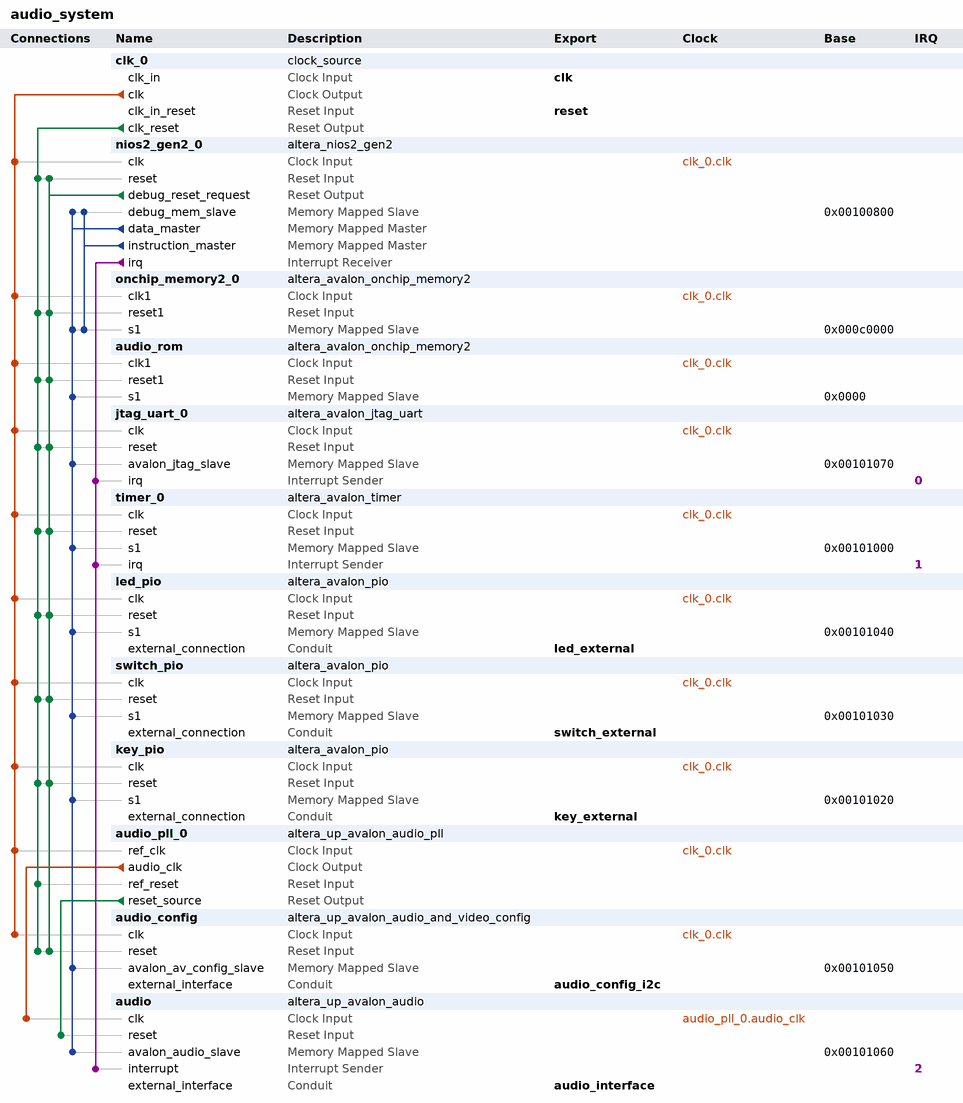
[diagram p0: system contents]
# Platform Designer (Qsys) system audio_system, Cyclone V 5CSXFC6D6F31C6
# Parameters at their usual value, and those the tool derives, are not listed.
package require -exact qsys 23.1
create_system audio_system
set_project_property DEVICE_FAMILY {Cyclone V}
set_project_property DEVICE 5CSXFC6D6F31C6

add_instance clk_0 clock_source 23.1
set_instance_parameter_value clk_0 clockFrequency 50000000

add_instance nios2_gen2_0 altera_nios2_gen2 23.1
set_instance_parameter_value nios2_gen2_0 dcache_size 2048
set_instance_parameter_value nios2_gen2_0 exceptionSlave onchip_memory2_0.s1
set_instance_parameter_value nios2_gen2_0 icache_size 4096
set_instance_parameter_value nios2_gen2_0 impl Tiny
set_instance_parameter_value nios2_gen2_0 resetSlave onchip_memory2_0.s1

add_instance onchip_memory2_0 altera_avalon_onchip_memory2 23.1
set_instance_parameter_value onchip_memory2_0 dataWidth 32
set_instance_parameter_value onchip_memory2_0 dualPort false
set_instance_parameter_value onchip_memory2_0 initMemContent true
set_instance_parameter_value onchip_memory2_0 initializationFileName onchip_mem.hex
set_instance_parameter_value onchip_memory2_0 memorySize 32767

add_instance audio_rom altera_avalon_onchip_memory2 23.1
set_instance_parameter_value audio_rom dataWidth 16
set_instance_parameter_value audio_rom dualPort false
set_instance_parameter_value audio_rom initMemContent true
set_instance_parameter_value audio_rom initializationFileName D:/FETEL_WorkDir/Y4S2_HeThongNhung/DE10_Standard_Audio/audio_data.mif
set_instance_parameter_value audio_rom memorySize 240254
set_instance_parameter_value audio_rom useNonDefaultInitFile true
set_instance_parameter_value audio_rom writable false

add_instance jtag_uart_0 altera_avalon_jtag_uart 23.1
set_instance_parameter_value jtag_uart_0 simInteractiveOptions NO_INTERACTIVE_WINDOWS

add_instance timer_0 altera_avalon_timer 23.1
set_instance_parameter_value timer_0 period 1
set_instance_parameter_value timer_0 periodUnits MSEC

add_instance led_pio altera_avalon_pio 23.1
set_instance_parameter_value led_pio direction Output
set_instance_parameter_value led_pio width 32

add_instance switch_pio altera_avalon_pio 23.1
set_instance_parameter_value switch_pio direction Input
set_instance_parameter_value switch_pio width 32

add_instance key_pio altera_avalon_pio 23.1
set_instance_parameter_value key_pio direction Input
set_instance_parameter_value key_pio width 32

add_instance audio_pll_0 altera_up_avalon_audio_pll 18.0
set_instance_parameter_value audio_pll_0 gui_refclk 50.0

add_instance audio_config altera_up_avalon_audio_and_video_config 18.0
set_instance_parameter_value audio_config audio_in {Line In to ADC}
set_instance_parameter_value audio_config bit_length 16
set_instance_parameter_value audio_config board DE10-Standard
set_instance_parameter_value audio_config line_in_bypass false
set_instance_parameter_value audio_config sampling_rate {48 kHz}

add_instance audio altera_up_avalon_audio 18.0
set_instance_parameter_value audio audio_in true
set_instance_parameter_value audio avalon_bus_type {Memory Mapped}
set_instance_parameter_value audio dw 16

# connections
add_connection audio_pll_0.audio_clk audio.clk clock
add_connection clk_0.clk audio_config.clk clock
add_connection clk_0.clk audio_pll_0.ref_clk clock
add_connection clk_0.clk audio_rom.clk1 clock
add_connection clk_0.clk jtag_uart_0.clk clock
add_connection clk_0.clk key_pio.clk clock
add_connection clk_0.clk led_pio.clk clock
add_connection clk_0.clk nios2_gen2_0.clk clock
add_connection clk_0.clk onchip_memory2_0.clk1 clock
add_connection clk_0.clk switch_pio.clk clock
add_connection clk_0.clk timer_0.clk clock
add_connection audio_pll_0.reset_source audio.reset reset
add_connection clk_0.clk_reset audio_config.reset reset
add_connection clk_0.clk_reset audio_pll_0.ref_reset reset
add_connection clk_0.clk_reset audio_rom.reset1 reset
add_connection clk_0.clk_reset jtag_uart_0.reset reset
add_connection clk_0.clk_reset key_pio.reset reset
add_connection clk_0.clk_reset led_pio.reset reset
add_connection clk_0.clk_reset nios2_gen2_0.reset reset
add_connection clk_0.clk_reset onchip_memory2_0.reset1 reset
add_connection clk_0.clk_reset switch_pio.reset reset
add_connection clk_0.clk_reset timer_0.reset reset
add_connection nios2_gen2_0.debug_reset_request audio_config.reset reset
add_connection nios2_gen2_0.debug_reset_request audio_rom.reset1 reset
add_connection nios2_gen2_0.debug_reset_request jtag_uart_0.reset reset
add_connection nios2_gen2_0.debug_reset_request key_pio.reset reset
add_connection nios2_gen2_0.debug_reset_request led_pio.reset reset
add_connection nios2_gen2_0.debug_reset_request nios2_gen2_0.reset reset
add_connection nios2_gen2_0.debug_reset_request onchip_memory2_0.reset1 reset
add_connection nios2_gen2_0.debug_reset_request switch_pio.reset reset
add_connection nios2_gen2_0.debug_reset_request timer_0.reset reset
add_connection nios2_gen2_0.data_master audio.avalon_audio_slave avalon
set_connection_parameter_value nios2_gen2_0.data_master/audio.avalon_audio_slave baseAddress 0x00101060
add_connection nios2_gen2_0.data_master audio_config.avalon_av_config_slave avalon
set_connection_parameter_value nios2_gen2_0.data_master/audio_config.avalon_av_config_slave baseAddress 0x00101050
add_connection nios2_gen2_0.data_master audio_rom.s1 avalon
set_connection_parameter_value nios2_gen2_0.data_master/audio_rom.s1 baseAddress 0x0000
add_connection nios2_gen2_0.data_master jtag_uart_0.avalon_jtag_slave avalon
set_connection_parameter_value nios2_gen2_0.data_master/jtag_uart_0.avalon_jtag_slave baseAddress 0x00101070
add_connection nios2_gen2_0.data_master key_pio.s1 avalon
set_connection_parameter_value nios2_gen2_0.data_master/key_pio.s1 baseAddress 0x00101020
add_connection nios2_gen2_0.data_master led_pio.s1 avalon
set_connection_parameter_value nios2_gen2_0.data_master/led_pio.s1 baseAddress 0x00101040
add_connection nios2_gen2_0.data_master nios2_gen2_0.debug_mem_slave avalon
set_connection_parameter_value nios2_gen2_0.data_master/nios2_gen2_0.debug_mem_slave baseAddress 0x00100800
add_connection nios2_gen2_0.data_master onchip_memory2_0.s1 avalon
set_connection_parameter_value nios2_gen2_0.data_master/onchip_memory2_0.s1 baseAddress 0x000c0000
add_connection nios2_gen2_0.data_master switch_pio.s1 avalon
set_connection_parameter_value nios2_gen2_0.data_master/switch_pio.s1 baseAddress 0x00101030
add_connection nios2_gen2_0.data_master timer_0.s1 avalon
set_connection_parameter_value nios2_gen2_0.data_master/timer_0.s1 baseAddress 0x00101000
add_connection nios2_gen2_0.instruction_master nios2_gen2_0.debug_mem_slave avalon
set_connection_parameter_value nios2_gen2_0.instruction_master/nios2_gen2_0.debug_mem_slave baseAddress 0x00100800
add_connection nios2_gen2_0.instruction_master onchip_memory2_0.s1 avalon
set_connection_parameter_value nios2_gen2_0.instruction_master/onchip_memory2_0.s1 baseAddress 0x000c0000
add_connection nios2_gen2_0.irq audio.interrupt interrupt
set_connection_parameter_value nios2_gen2_0.irq/audio.interrupt irqNumber 2
add_connection nios2_gen2_0.irq jtag_uart_0.irq interrupt
set_connection_parameter_value nios2_gen2_0.irq/jtag_uart_0.irq irqNumber 0
add_connection nios2_gen2_0.irq timer_0.irq interrupt
set_connection_parameter_value nios2_gen2_0.irq/timer_0.irq irqNumber 1

# exported interfaces
add_interface audio_config_i2c conduit end
set_interface_property audio_config_i2c EXPORT_OF audio_config.external_interface
add_interface audio_interface conduit end
set_interface_property audio_interface EXPORT_OF audio.external_interface
add_interface clk clock sink
set_interface_property clk EXPORT_OF clk_0.clk_in
add_interface key_external conduit end
set_interface_property key_external EXPORT_OF key_pio.external_connection
add_interface led_external conduit end
set_interface_property led_external EXPORT_OF led_pio.external_connection
add_interface reset reset sink
set_interface_property reset EXPORT_OF clk_0.clk_in_reset
add_interface switch_external conduit end
set_interface_property switch_external EXPORT_OF switch_pio.external_connection

set_interconnect_requirement {$system} qsys_mm.clockCrossingAdapter HANDSHAKE
set_interconnect_requirement {$system} qsys_mm.enableEccProtection FALSE
set_interconnect_requirement {$system} qsys_mm.insertDefaultSlave FALSE
set_interconnect_requirement {$system} qsys_mm.maxAdditionalLatency 1

save_system audio_system.qsys
